# Altium schematic sheet OSP_Carrier_V7_Release_DJB.SchDoc: OSP Full Carrier Board
size C; DrawnBy: LP; Revision: 1; SheetNumber: 3; SheetTotal: 7
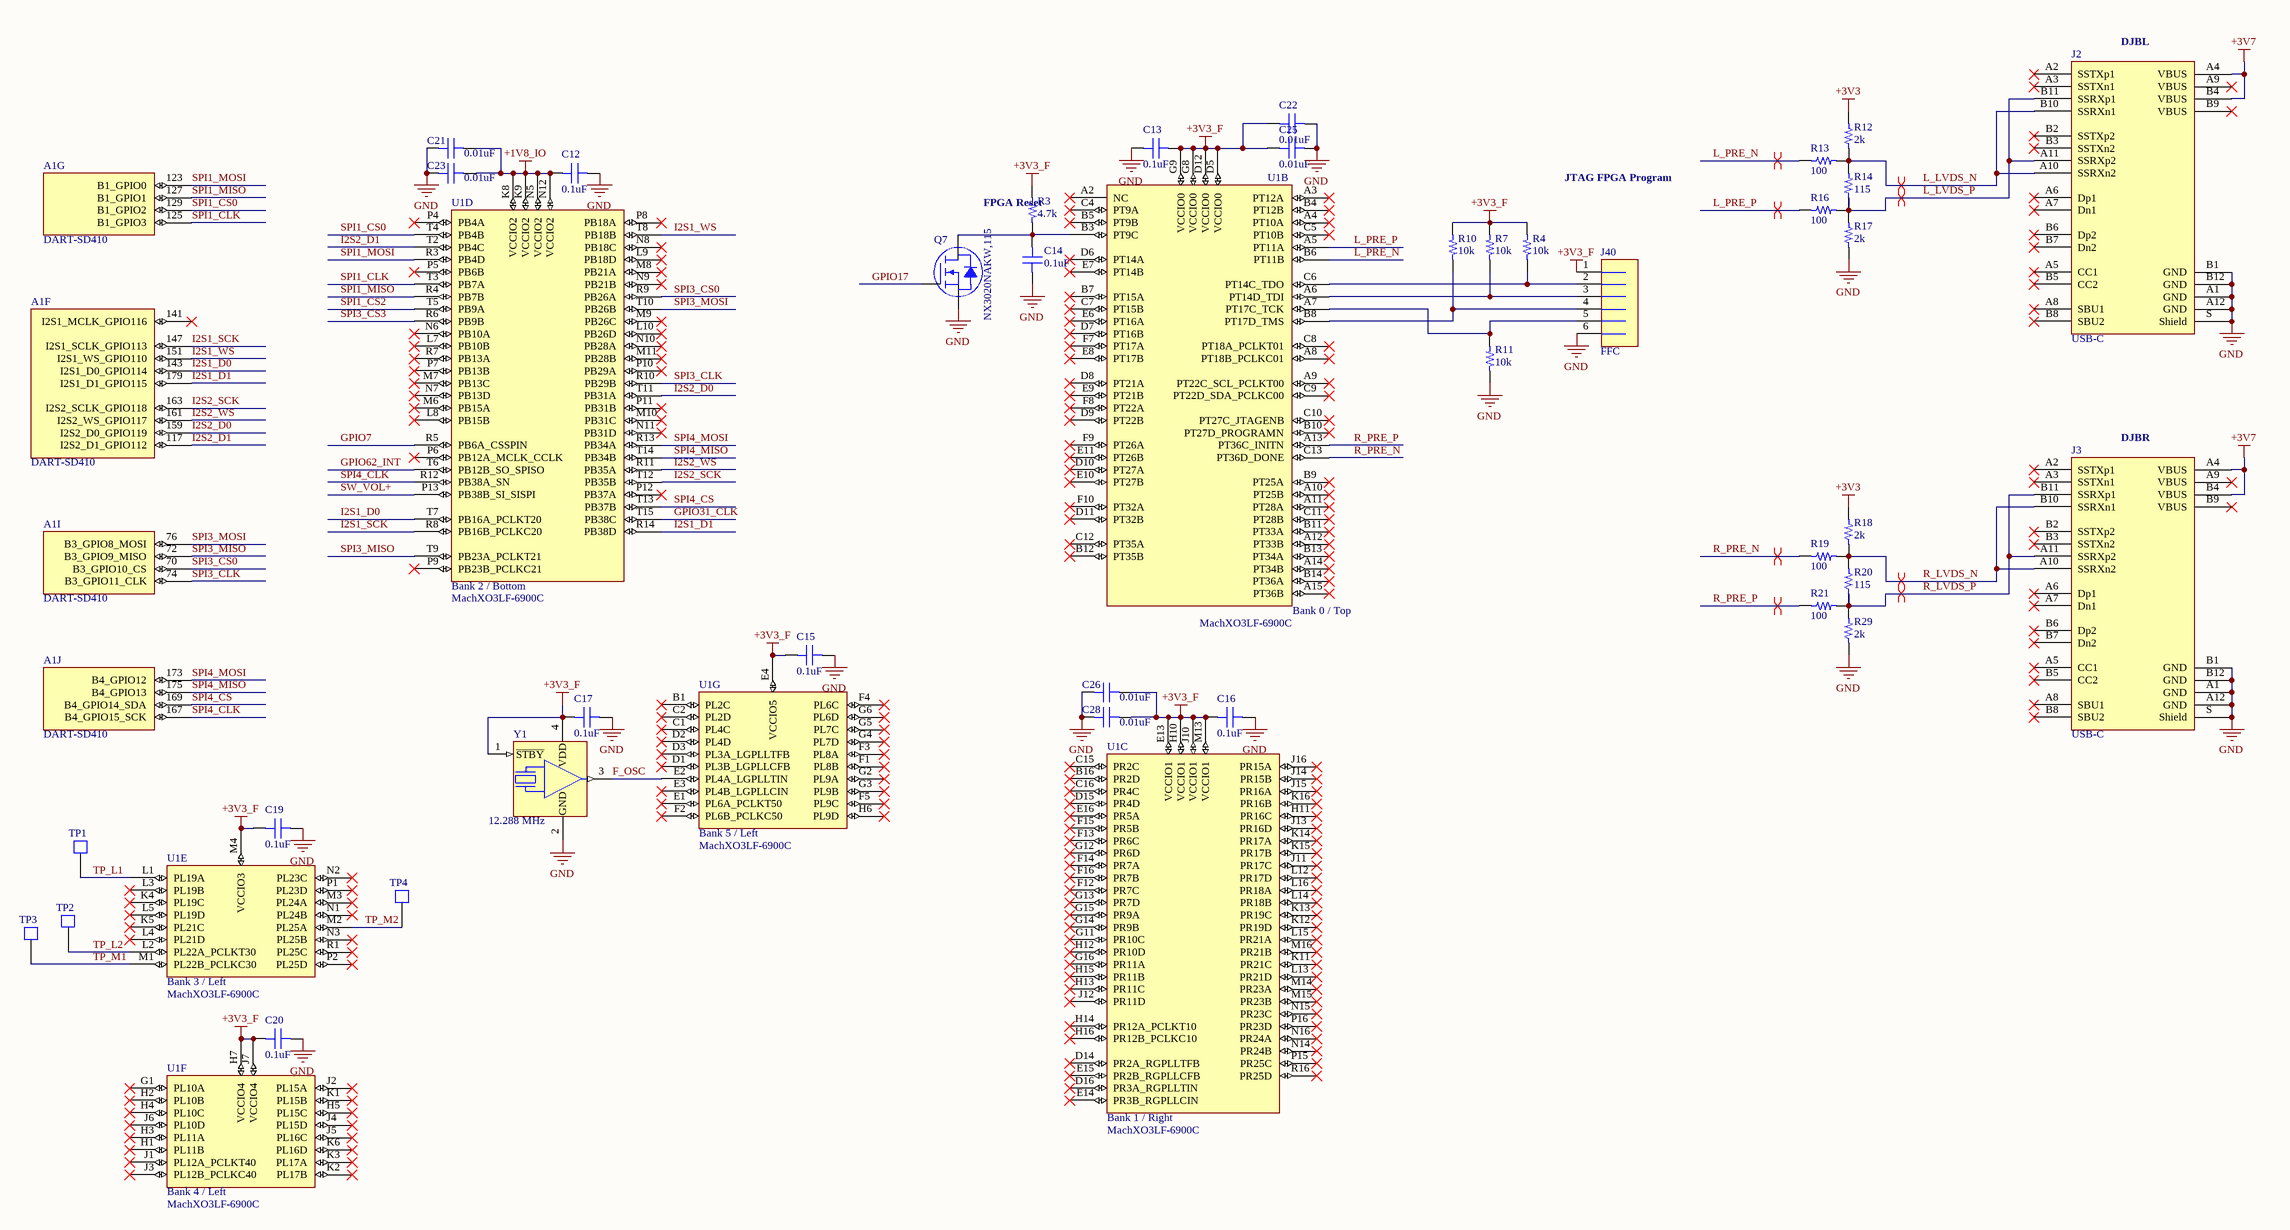
[diagram p0: OSP_Carrier_V7_Release_DJB.SchDoc]

## Parts
A1  DART-SD410  [DART-SD410]  (parts F,G,I,J of 15)
C12  0.1uF  [CAP 0402/1005]
C13  0.1uF  [CAP 0402/1005]
C14  0.1uF  [CAP 0402/1005]
C15  0.1uF  [CAP 0402/1005]
C16  0.1uF  [CAP 0402/1005]
C17  0.1uF  [CAP 0402/1005]
C19  0.1uF  [CAP 0402/1005]
C20  0.1uF  [CAP 0402/1005]
C21  0.01uF  [CAP 0402/1005]
C22  0.01uF  [CAP 0402/1005]
C23  0.01uF  [CAP 0402/1005]
C25  0.01uF  [CAP 0402/1005]
C26  0.01uF  [CAP 0402/1005]
C28  0.01uF  [CAP 0402/1005]
J2  USB-C  [TE_USB-C_2129691-1]
J3  USB-C  [TE_USB-C_2129691-1]
J40  FFC  [AMPHENOL_HFW6R-1STE1LF]
Q7  NX3020NAKW,115  [NXP SOT-323-3]
R3  4.7k  [RES 0402/1005]
R4  10k  [RES 0402/1005]
R7  10k  [RES 0402/1005]
R10  10k  [RES 0402/1005]
R11  10k  [RES 0402/1005]
R12  2k  [RES 0402/1005]
R13  100  [RES 0402/1005]
R14  115  [RES 0402/1005]
R16  100  [RES 0402/1005]
R17  2k  [RES 0402/1005]
R18  2k  [RES 0402/1005]
R19  100  [RES 0402/1005]
R20  115  [RES 0402/1005]
R21  100  [RES 0402/1005]
R29  2k  [RES 0402/1005]
TP1  TP_SMD_1MM_SQ  [TP_SMD_1MM_SQ]  (value not drawn)
TP2  TP_SMD_1MM_SQ  [TP_SMD_1MM_SQ]  (value not drawn)
TP3  TP_SMD_1MM_SQ  [TP_SMD_1MM_SQ]  (value not drawn)
TP4  TP_SMD_1MM_SQ  [TP_SMD_1MM_SQ]  (value not drawn)
U1  MachXO3LF-6900C  [LCMXO3_caBGA_BG256]  (parts B,C,D,E,F,G of 7)
Y1  12.288 MHz  [OSC_2.5x2.0mm]

## Nets
+1V8_IO: C12.2 C21.1 C23.1 U1.K8(VCCIO2) U1.K9(VCCIO2) U1.N5(VCCIO2) U1.N12(VCCIO2)
+3V3: R12.2 R18.2
+3V3_F: C13.2 C15.2 C16.2 C17.2 C19.2 C20.2 C22.1 C25.1 C26.1 C28.1 J40.1 R3.2 R4.2 R7.2 R10.2 U1.D5(VCCIO0) U1.D12(VCCIO0) U1.E4(VCCIO5) U1.E13(VCCIO1) U1.G8(VCCIO0) U1.G9(VCCIO0) U1.H7(VCCIO4) U1.H10(VCCIO1) U1.J7(VCCIO4) U1.J10(VCCIO1) U1.M4(VCCIO3) U1.M13(VCCIO1) Y1.1(~{STBY}) Y1.4(VDD)
+3V7: J2.A4(VBUS) J2.B4(VBUS) J3.A4(VBUS) J3.B4(VBUS)
GND: C12.1 C13.1 C14.2 C15.1 C16.1 C17.1 C19.1 C20.1 C21.2 C22.2 C23.2 C25.2 C26.2 C28.2 J2.A1(GND) J2.A12(GND) J2.B1(GND) J2.B12(GND) J2.S(Shield) J3.A1(GND) J3.A12(GND) J3.B1(GND) J3.B12(GND) J3.S(Shield) J40.6 Q7.3(S) R11.1 R17.1 R29.1 Y1.2(GND)
F_OSC: U1.E2(PL4A_LGPLLTIN) Y1.3(OUT)
GPIO7: U1.R5(PB6A_CSSPIN)
GPIO17: Q7.1(G)
GPIO31_CLK: U1.T15(PB38C)
GPIO62_INT: U1.T6(PB12B_SO_SPISO)
I2S1_D0: A1.143(I2S1_D0_GPIO114) U1.T7(PB16A_PCLKT20)
I2S1_D1: A1.179(I2S1_D1_GPIO115) U1.R14(PB38D)
I2S1_SCK: A1.147(I2S1_SCLK_GPIO113) U1.R8(PB16B_PCLKC20)
I2S1_WS: A1.151(I2S1_WS_GPIO110) U1.T8(PB18B)
I2S2_D0: A1.159(I2S2_D0_GPIO119) U1.T11(PB31A)
I2S2_D1: A1.117(I2S2_D1_GPIO112) U1.T2(PB4C)
I2S2_SCK: A1.163(I2S2_SCLK_GPIO118) U1.T12(PB35B)
I2S2_WS: A1.161(I2S2_WS_GPIO117) U1.R11(PB35A)
L_LVDS_N: J2.A10(SSRXn2) J2.B10(SSRXn1) R12.1 R13.2 R14.2
L_LVDS_P: J2.A11(SSRXp2) J2.B11(SSRXp1) R14.1 R16.2 R17.2
L_PRE_N: R13.1 U1.B6(PT11B)
L_PRE_P: R16.1 U1.A5(PT11A)
R_LVDS_N: J3.A10(SSRXn2) J3.B10(SSRXn1) R18.1 R19.2 R20.2
R_LVDS_P: J3.A11(SSRXp2) J3.B11(SSRXp1) R20.1 R21.2 R29.2
R_PRE_N: R19.1 U1.C13(PT36D_DONE)
R_PRE_P: R21.1 U1.A13(PT36C_INITN)
SPI1_CLK: A1.125(B1_GPIO3) U1.T3(PB7A)
SPI1_CS0: A1.129(B1_GPIO2) U1.T4(PB4B)
SPI1_CS2: U1.T5(PB9A)
SPI1_MISO: A1.127(B1_GPIO1) U1.R4(PB7B)
SPI1_MOSI: A1.123(B1_GPIO0) U1.R3(PB4D)
SPI3_CLK: A1.74(B3_GPIO11_CLK) U1.R10(PB29B)
SPI3_CS0: A1.70(B3_GPIO10_CS) U1.R9(PB26A)
SPI3_CS3: U1.R6(PB9B)
SPI3_MISO: A1.72(B3_GPIO9_MISO) U1.T9(PB23A_PCLKT21)
SPI3_MOSI: A1.76(B3_GPIO8_MOSI) U1.T10(PB26B)
SPI4_CLK: A1.167(B4_GPIO15_SCK) U1.R12(PB38A_SN)
SPI4_CS: A1.169(B4_GPIO14_SDA) U1.T13(PB37B)
SPI4_MISO: A1.175(B4_GPIO13) U1.T14(PB34B)
SPI4_MOSI: A1.173(B4_GPIO12) U1.R13(PB34A)
SW_VOL+: U1.P13(PB38B_SI_SISPI)
TP_L1: TP1.1 U1.L1(PL19A)
TP_L2: TP2.1 U1.L2(PL22A_PCLKT30)
TP_M1: TP3.1 U1.M1(PL22B_PCLKC30)
TP_M2: TP4.1 U1.M2(PL25A)
NetC14_1: C14.1 Q7.2(D) R3.1 U1.B3(PT9C)
NetJ40_2: J40.2 R4.1 U1.C6(PT14C_TDO)
NetJ40_3: J40.3 R7.1 U1.A6(PT14D_TDI)
NetJ40_4: J40.4 R10.1 U1.B8(PT17D_TMS)
NetJ40_5: J40.5 R11.2 U1.A7(PT17C_TCK)

Not connected (* = marked no-connect by the designer): A1 141(I2S1_MCLK_GPIO116)*; J2 A2(SSTXp1)* A3(SSTXn1)* A5(CC1)* A6(Dp1)* A7(Dn1)* A8(SBU1)* A9(VBUS)* B2(SSTXp2)* B3(SSTXn2)* B5(CC2)* B6(Dp2)* B7(Dn2)* B8(SBU2)* B9(VBUS)*; J3 A2(SSTXp1)* A3(SSTXn1)* A5(CC1)* A6(Dp1)* A7(Dn1)* A8(SBU1)* A9(VBUS)* B2(SSTXp2)* B3(SSTXn2)* B5(CC2)* B6(Dp2)* B7(Dn2)* B8(SBU2)* B9(VBUS)*; U1 A2(NC)* A3(PT12A)* A4(PT10A)* A8(PT18B_PCLKC01)* A9(PT22C_SCL_PCLKT00)* A10(PT25B)* A11(PT28A)* A12(PT33B)* A14(PT34B)* A15(PT36B)* B1(PL2C)* B4(PT12B)* B5(PT9B)* B7(PT15A)* B9(PT25A)* B10(PT27D_PROGRAMN)* B11(PT33A)* B12(PT35B)* B13(PT34A)* B14(PT36A)* B16(PR2D)* C1(PL4C)* C2(PL2D)* C4(PT9A)* C5(PT10B)* C7(PT15B)* C8(PT18A_PCLKT01)* C9(PT22D_SDA_PCLKC00)* C10(PT27C_JTAGENB)* C11(PT28B)* C12(PT35A)* C15(PR2C)* C16(PR4C)* D1(PL3B_LGPLLCFB)* D2(PL4D)* D3(PL3A_LGPLLTFB)* D6(PT14A)* D7(PT16B)* D8(PT21A)* D9(PT22B)* D10(PT27A)* D11(PT32B)* D14(PR2A_RGPLLTFB)* D15(PR4D)* D16(PR3A_RGPLLTIN)* E1(PL6A_PCLKT50)* E3(PL4B_LGPLLCIN)* E6(PT16A)* E7(PT14B)* E8(PT17B)* E9(PT21B)* E10(PT27B)* E11(PT26B)* E14(PR3B_RGPLLCIN)* E15(PR2B_RGPLLCFB)* E16(PR5A)* F1(PL8B)* F2(PL6B_PCLKC50)* F3(PL8A)* F4(PL6C)* F5(PL9C)* F7(PT17A)* F8(PT22A)* F9(PT26A)* F10(PT32A)* F12(PR7C)* F13(PR6C)* F14(PR7A)* F15(PR5B)* F16(PR7B)* G1(PL10A)* G2(PL9A)* G3(PL9B)* G4(PL7D)* G5(PL7C)* G6(PL6D)* G11(PR10C)* G12(PR6D)* G13(PR7D)* G14(PR9B)* G15(PR9A)* G16(PR11A)* H1(PL11B)* H2(PL10B)* H3(PL11A)* H4(PL10C)* H5(PL15C)* H6(PL9D)* H11(PR16C)* H12(PR10D)* H13(PR11C)* H14(PR12A_PCLKT10)* H15(PR11B)* H16(PR12B_PCLKC10)* J1(PL12A_PCLKT40)* J2(PL15A)* J3(PL12B_PCLKC40)* J4(PL15D)* J5(PL16C)* J6(PL10D)* J11(PR17C)* J12(PR11D)* J13(PR16D)* J14(PR15B)* J15(PR16A)* J16(PR15A)* K1(PL15B)* K2(PL17B)* K3(PL17A)* K4(PL19C)* K5(PL21C)* K6(PL16D)* K11(PR21C)* K12(PR19D)* K13(PR19C)* K14(PR17A)* K15(PR17B)* K16(PR16B)* L3(PL19B)* L4(PL21D)* L5(PL19D)* L7(PB10B)* L8(PB15B)* L9(PB18D)* L10(PB26D)* L12(PR17D)* L13(PR21D)* L14(PR18B)* L15(PR21A)* L16(PR18A)* M3(PL24A)* M6(PB15A)* M7(PB13C)* M8(PB21A)* M9(PB26C)* M10(PB31C)* M11(PB28B)* M14(PR23A)* M15(PR23B)* M16(PR21B)* N1(PL24B)* N2(PL23C)* N3(PL25B)* N6(PB10A)* N7(PB13D)* N8(PB18C)* N9(PB21B)* N10(PB28A)* N11(PB31D)* N14(PR24B)* N15(PR23C)* N16(PR24A)* P1(PL23D)* P2(PL25D)* P4(PB4A)* P5(PB6B)* P6(PB12A_MCLK_CCLK)* P7(PB13B)* P8(PB18A)* P9(PB23B_PCLKC21)* P10(PB29A)* P11(PB31B)* P12(PB37A)* P15(PR25C)* P16(PR23D)* R1(PL25C)* R7(PB13A)* R16(PR25D)*

## Layout directives
differential pair: L_LVDS_N, L_LVDS_P, L_PRE_N, L_PRE_P, R_LVDS_N, R_LVDS_P, R_PRE_N, R_PRE_P

## Notes on the sheet
- (near J2) DJBL
- FPGA Reset
- JTAG FPGA Program
- (near J3) DJBR
- Title
- Size:
- Date:
- B
- Revision:
- Time:
- Drawn By:
- Approved:
- Sheet
- of
- LACI
- Atkinson Hall, 5202
- UC San Diego
- 9500 Gilman Drive #0436
- La Jolla, CA 92093-0436
- File:
- (in symbol LCMXO3LF-6900C-XBG256X, part B) Bank 0 / Top
- (in symbol LCMXO3LF-6900C-XBG256X, part C) Bank 1 / Right
- (in symbol LCMXO3LF-6900C-XBG256X, part D) Bank 2 / Bottom
- (in symbol LCMXO3LF-6900C-XBG256X, part E) Bank 3 / Left
- (in symbol LCMXO3LF-6900C-XBG256X, part F) Bank 4 / Left
- (in symbol LCMXO3LF-6900C-XBG256X, part G) Bank 5 / Left

## Library data of the parts
A1 = DART-SD410: Variscite DART-SD410 System on Module
C12-C17 C19 C20 = C1005X7R1H104K050BB: CAP CER 0.1UF 50V X7R 0402; Manufacturer: TDK Corporation; TemperatureRange: -55C ~ 125C; Tolerance: 10%; Value: 0.1uF; Part Number: C1005X7R1H104K050BB; PartId: 3860; Supplier 1: Digi-Key; Supplier Part Number 1: 445-5932-2-ND; ComponentLink1Description: Datasheet; ComponentLink1URL: https://product.tdk.com/info/en/catalog/datasheets/mlcc_commercial_general_en.pdf; ComponentLink2Description: Digi-Key listing; ComponentLink2URL: http://digikey.com/product-detail/en/C1005X7R1H104K050BB/445-5932-2-ND/2443410; TemperatureCoefficient: X7R; Voltage: 50V; Price: 0.0287; Type: -; Device Package: 0402 (1005 Metric)
C21-C23 C25 C26 C28 = CC0402KRX7R8BB103: CAP CER 10000PF 25V X7R 0402; Manufacturer: Yageo; TemperatureRange: -55C ~ 125C; Tolerance: 10%; Value: 0.01uF; Part Number: CC0402KRX7R8BB103; PartId: 12361; Supplier 1: Digi-Key; Supplier Part Number 1: 311-1337-2-ND; ComponentLink1Description: Datasheet; ComponentLink1URL: http://www.yageo.com/documents/recent/UPY-GPHC_X7R_6.3V-to-50V_13.pdf; ComponentLink2Description: Digi-Key Listing; ComponentLink2URL: https://www.digikey.com/product-detail/en/yageo/CC0402KRX7R8BB103/311-1337-2-ND/2103075; TemperatureCoefficient: X7R; Voltage: 25V; Price: 0.0017; Device Package: 0402 (1005 Metric)
J2 J3 = TE_USB_C_2129691-1: TE 2129691-1 USB-C Socket
J40 = AMPHENOL_HFW6R-1STE1LF: Amphenol HFW6R-1STE1LF 6-pin flat flexible cable connector
Q7 = NX3020NAKW,115: MOSFET N-CH 30V 180MA SOT323; Part Number: NX3020NAKW,115
R3 = ERJ-2RKF4701X: RES SMD 4.7K OHM 1% 1/10W 0402; Manufacturer: Panasonic Electronic Components; TemperatureRange: -55C ~ 155C; TemperatureCoefficient: 100ppm/C; PowerRating: 0.1W, 1/10W; Value: 4.7k; Part Number: ERJ-2RKF4701X; PartId: 5; Supplier 1: Digi-Key; Supplier Part Number 1: P4.70KLTR-ND; ComponentLink1Description: Datasheet; ComponentLink1URL: http://industrial.panasonic.com/www-cgi/jvcr13pz.cgi?E+PZ+3+AOA0002+ERJ2RKF4701X+7+WW; ComponentLink2Description: Digikey listing; ComponentLink2URL: http://digikey.com/product-detail/en/ERJ-2RKF4701X/P4.70KLTR-ND/1746231; Tolerance: 1%; Price: 0.0043; Type: Thick Film; Device Package: 0402 (1005 Metric)
R4 R7 R10 R11 = ERJ-2RKF1002X: RES SMD 10K OHM 1% 1/10W 0402; Manufacturer: Panasonic Electronic Components; TemperatureRange: -55C ~ 155C; TemperatureCoefficient: 100ppm/C; PowerRating: 0.1W, 1/10W; Value: 10k; Part Number: ERJ-2RKF1002X; PartId: 1; Supplier 1: Digi-Key; Supplier Part Number 1: P10.0KLTR-ND; ComponentLink1Description: Datasheet; ComponentLink1URL: http://industrial.panasonic.com/www-cgi/jvcr13pz.cgi?E+PZ+3+AOA0002+ERJ2RKF1002X+7+WW; ComponentLink2Description: Digikey listing; ComponentLink2URL: http://digikey.com/product-detail/en/ERJ-2RKF1002X/P10.0KLTR-ND/192073; Tolerance: 1%; Price: 0.0043; Type: Thick Film; Device Package: 0402 (1005 Metric)
R12 R17 R18 R29 = ERJ-2RKF2001X: RES SMD 2K OHM 1% 1/10W 0402; Manufacturer: Panasonic Electronic Components; TemperatureRange: -55C ~ 155C; TemperatureCoefficient: 100ppm/C; PowerRating: 0.1W, 1/10W; Value: 2k; Part Number: ERJ-2RKF2001X; PartId: 16; Supplier 1: Digi-Key; Supplier Part Number 1: P2.00KLTR-ND; ComponentLink1Description: Datasheet; ComponentLink1URL: http://industrial.panasonic.com/www-cgi/jvcr13pz.cgi?E+PZ+3+AOA0002+ERJ2RKF2001X+7+WW; ComponentLink2Description: Digikey listing; ComponentLink2URL: http://digikey.com/product-detail/en/ERJ-2RKF2001X/P2.00KLTR-ND/192194; Tolerance: 1%; Price: 0.0043; Type: Thick Film; Device Package: 0402 (1005 Metric)
R13 R16 R19 R21 = ERJ-2RKF1000X: RES SMD 100 OHM 1% 1/10W 0402; Manufacturer: Panasonic Electronic Components; TemperatureRange: -55C ~ 155C; TemperatureCoefficient: 100ppm/C; PowerRating: 0.1W, 1/10W; Value: 100; Part Number: ERJ-2RKF1000X; PartId: 3; Supplier 1: Digi-Key; Supplier Part Number 1: P100LTR-ND; ComponentLink1Description: Datasheet; ComponentLink1URL: http://industrial.panasonic.com/www-cgi/jvcr13pz.cgi?E+PZ+3+AOA0002+ERJ2RKF1000X+7+WW; ComponentLink2Description: Digikey listing; ComponentLink2URL: http://digikey.com/product-detail/en/ERJ-2RKF1000X/P100LTR-ND/192080; Tolerance: 1%; Price: 0.0043; Type: Thick Film; Device Package: 0402 (1005 Metric)
R14 R20 = ERJ-2RKF1150X: RES SMD 115 OHM 1% 1/10W 0402; Manufacturer: Panasonic Electronic Components; TemperatureRange: -55C ~ 155C; TemperatureCoefficient: 100ppm/C; PowerRating: 0.1W, 1/10W; Value: 115; Part Number: ERJ-2RKF1150X; PartId: 127; Supplier 1: Digi-Key; Supplier Part Number 1: P115LTR-ND; ComponentLink1Description: Datasheet; ComponentLink1URL: http://industrial.panasonic.com/www-cgi/jvcr13pz.cgi?E+PZ+3+AOA0002+ERJ2RKF1150X+7+WW; ComponentLink2Description: Digikey listing; ComponentLink2URL: http://digikey.com/product-detail/en/ERJ-2RKF1150X/P115LTR-ND/192100; Tolerance: 1%; Price: 0.0035; Type: Thick Film; Device Package: 0402 (1005 Metric)
TP1-TP4 = TP_SMD_1MM_SQ: 1mm Square SMD Test Point; DNP: DNP
U1 = LCMXO3LF-6900C-XBG256X: Lattice MachXO3LF-6900C-5BG256C FPGA
Y1 = MC_DSC1033DI2-012.2880: Microchip 12.288 MHz SMD MEMS Oscillator; DIGIKEY_PN: DSC1033DI2-012.2880-ND